# Altium schematic sheet RAM Bus.SchDoc
size A4; SheetNumber: 3
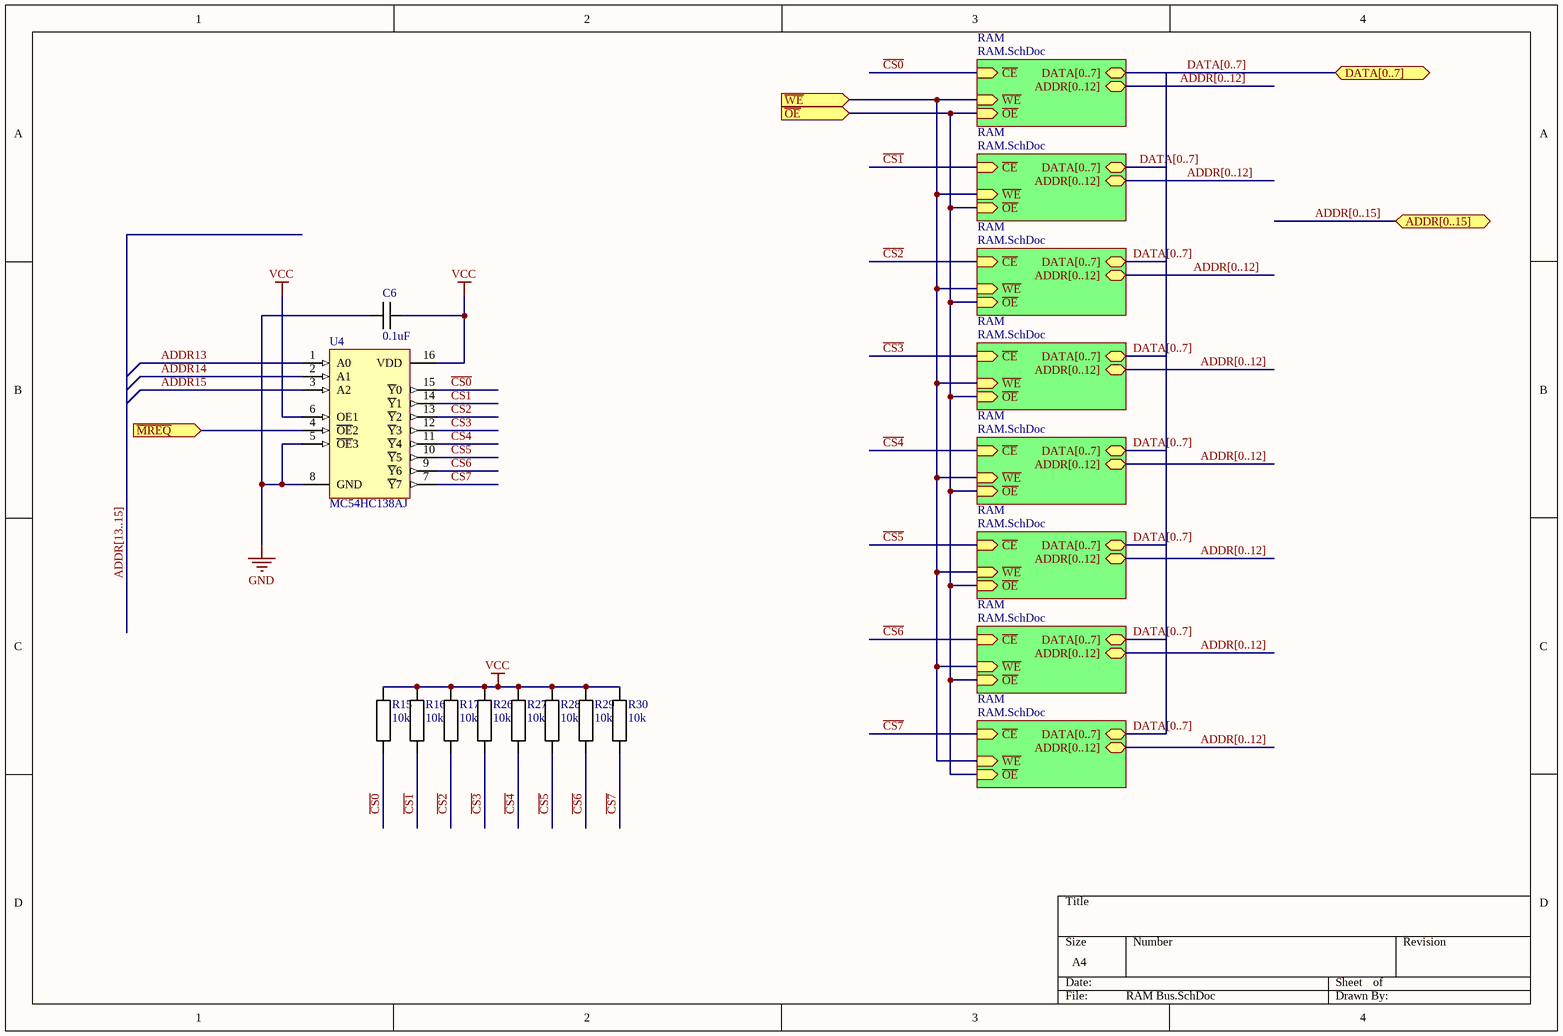
[diagram p0: RAM Bus.SchDoc]

## Parts
C6  0.1uF  [SMD 0603]
R15  10k  [SMD 0603]
R16  10k  [SMD 0603]
R17  10k  [SMD 0603]
R26  10k  [SMD 0603]
R27  10k  [SMD 0603]
R28  10k  [SMD 0603]
R29  10k  [SMD 0603]
R30  10k  [SMD 0603]
U4  MC54HC138AJ  [620-09]

## Sub-sheets
RAM = RAM.SchDoc: DATA[0..7] (bidir), ADDR[0..12] (bidir), ~{WE} (in), ~{CE} (in), ~{OE} (in)
RAM = RAM.SchDoc: DATA[0..7] (bidir), ADDR[0..12] (bidir), ~{WE} (in), ~{CE} (in), ~{OE} (in)
RAM = RAM.SchDoc: DATA[0..7] (bidir), ADDR[0..12] (bidir), ~{WE} (in), ~{CE} (in), ~{OE} (in)
RAM = RAM.SchDoc: DATA[0..7] (bidir), ADDR[0..12] (bidir), ~{WE} (in), ~{CE} (in), ~{OE} (in)
RAM = RAM.SchDoc: DATA[0..7] (bidir), ADDR[0..12] (bidir), ~{WE} (in), ~{CE} (in), ~{OE} (in)
RAM = RAM.SchDoc: DATA[0..7] (bidir), ADDR[0..12] (bidir), ~{WE} (in), ~{CE} (in), ~{OE} (in)
RAM = RAM.SchDoc: DATA[0..7] (bidir), ADDR[0..12] (bidir), ~{WE} (in), ~{CE} (in), ~{OE} (in)
RAM = RAM.SchDoc: DATA[0..7] (bidir), ADDR[0..12] (bidir), ~{WE} (in), ~{CE} (in), ~{OE} (in)

## Ports
ADDR[0..15] (bidir), DATA[0..7] (bidir), ~{MREQ} (in), ~{OE} (in), ~{WE} (in)

## Nets
GND: C6.1 U4.5(~{OE}3) U4.8(GND)
VCC: C6.2 R15.2 R16.2 R17.2 R26.2 R27.2 R28.2 R29.2 R30.2 U4.6(OE1) U4.16(VDD)
~{CS0}: R15.1 U4.15(~{Y}0) ; sheet RAM/~{CE}
~{CS1}: R16.1 U4.14(~{Y}1) ; sheet RAM/~{CE}
~{CS2}: R17.1 U4.13(~{Y}2) ; sheet RAM/~{CE}
~{CS3}: R26.1 U4.12(~{Y}3) ; sheet RAM/~{CE}
~{CS4}: R27.1 U4.11(~{Y}4) ; sheet RAM/~{CE}
~{CS5}: R28.1 U4.10(~{Y}5) ; sheet RAM/~{CE}
~{CS6}: R29.1 U4.9(~{Y}6) ; sheet RAM/~{CE}
~{CS7}: R30.1 U4.7(~{Y}7) ; sheet RAM/~{CE}
~{MREQ}: U4.4(~{OE}2) ; port ~{MREQ}
~{OE}: port ~{OE}, sheet RAM/~{OE}, sheet RAM/~{OE}, sheet RAM/~{OE}, sheet RAM/~{OE}, sheet RAM/~{OE}, sheet RAM/~{OE}, sheet RAM/~{OE}, sheet RAM/~{OE}
~{WE}: port ~{WE}, sheet RAM/~{WE}, sheet RAM/~{WE}, sheet RAM/~{WE}, sheet RAM/~{WE}, sheet RAM/~{WE}, sheet RAM/~{WE}, sheet RAM/~{WE}, sheet RAM/~{WE}
ADDR13: U4.1(A0)
ADDR14: U4.2(A1)
ADDR15: U4.3(A2)

## Buses and harness runs
bus ADDR[0..12] = sheet RAM/ADDR[0..12]
bus ADDR[0..15] = port ADDR[0..15]
bus ADDR[13..15]
bus DATA[0..7] = port DATA[0..7] = sheet RAM/DATA[0..7]

## Library data of the parts
C6 = Capasitor: Value: 0.1uF
R15-R17 R26-R30 = Resistor: Value: 10k
U4 = MC54HC138AJ: 1-of-8 Decoder/Demultiplexer; Published: 17-Jul-2002; LatestRevisionDate: 06-Jun-2005; LatestRevisionNote: Stylized 3D Model Added; DatasheetVersion: 1989; PackageReference: 620-09; Publisher: Altium Limited; PackageDescription: DIP; 16 Leads; Row Spacing 7.62 mm; Pitch 2.54 mm; Code_JEDEC: MS-001-BB; ComponentLink1Description: Manufacturer Link; ComponentLink1URL: http://www.onsemi.com/site/products/parametrics/0,4446,419,00.html; ComponentLink2Description: Datasheet; ComponentLink2URL: http://www.onsemi.com/pub/Collateral/MC74HC138A-D.PDF